# EAGLE design PiezoAmpHVDC (EAGLE 6.5.0)
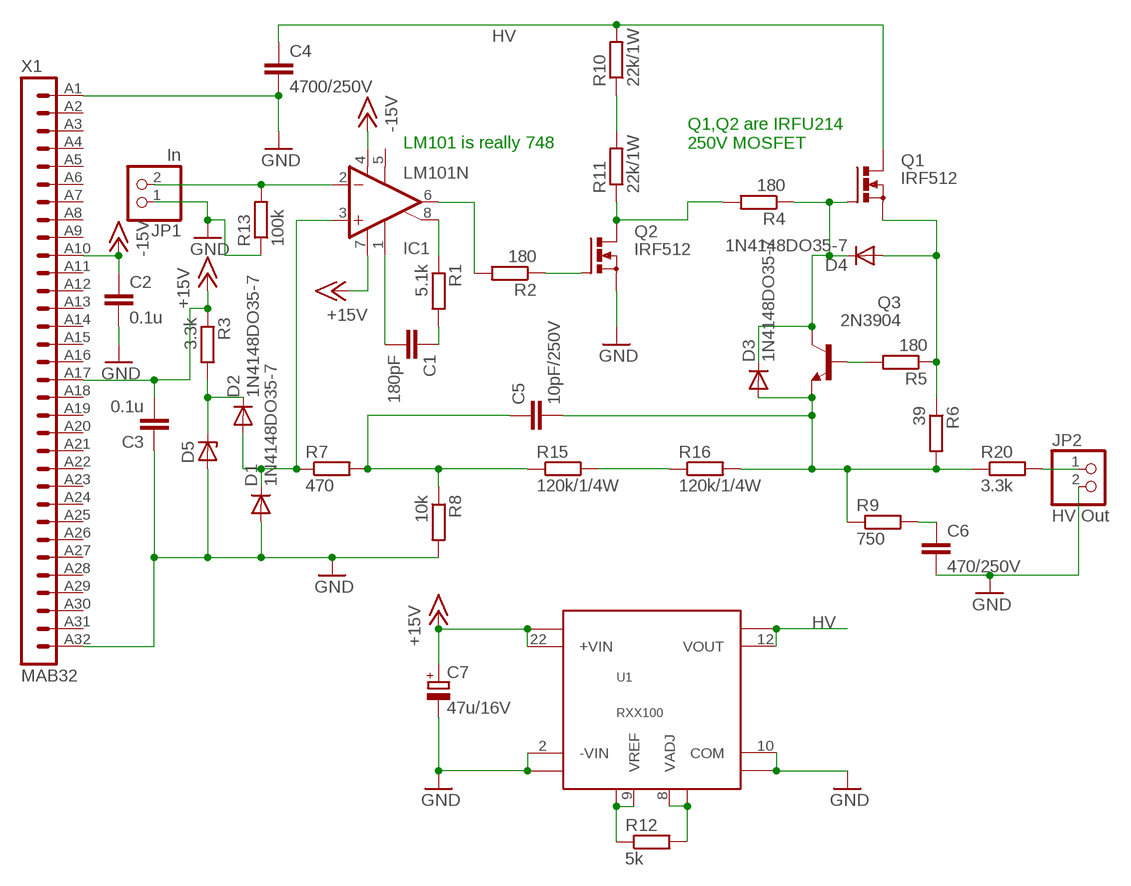
[diagram p0: schematic, sheet 1]

## Parts
C1  180pF  C-EU050-030X075  [C050-030X075]
C2  0.1u  C-EU050-030X075  [C050-030X075]
C3  0.1u  C-EU050-030X075  [C050-030X075]
C4  4700/250V  C-EU075-032X103  [C075-032X103]
C5  10pF/250V  C-EU075-032X103  [C075-032X103]
C6  470/250V  C-EU075-032X103  [C075-032X103]
C7  47u/16V  CPOL-EUSANYO_F8  [SANYO-OSCON_F8]
D1  1N4148DO35-7  [DO35-7]
D2  1N4148DO35-7  [DO35-7]
D3  1N4148DO35-7  [DO35-7]
D4  1N4148DO35-7  [DO35-7]
D5  ZENER-DIODEDO34-7  [DO34Z7]
IC1  LM101N  [DIL08]
JP1  In  PINHD-1X2  [1X02]
JP2  HV Out  PINHD-1X2  [1X02]
Q1  IRF512  [TO220BV]
Q2  IRF512  [TO220BV]
Q3  2N3904  [TO92]
R1  5.1k  R-EU_0204/7  [0204/7]
R2  180  R-EU_0204/7  [0204/7]
R3  3.3k  R-EU_0204/7  [0204/7]
R4  180  R-EU_0204/7  [0204/7]
R5  180  R-EU_0204/7  [0204/7]
R6  39  R-EU_0204/7  [0204/7]
R7  470  R-EU_0204/7  [0204/7]
R8  10k  R-EU_0204/7  [0204/7]
R9  750  R-EU_0204/7  [0204/7]
R10  22k/1W  R-EU_0411/15  [0411/15]
R11  22k/1W  R-EU_0411/15  [0411/15]
R12  5k  R-EU_0204/7  [0204/7]
R13  100k  R-EU_0204/5  [0204/5]
R15  120k/1/4W  R-EU_0411/15  [0411/15]
R16  120k/1/4W  R-EU_0411/15  [0411/15]
R20  3.3k  R-EU_0204/7  [0204/7]
U1  RXX100  [RXXDIP]
X1  MAB32  [MAB32]

## Nets
+15V: C3.2 C7.+ IC1.7(V+) R3.1 U1.22(+VIN) U1.23(VIN2+) X1.A17
-15V: C2.1 IC1.4(V-) X1.A10
GND: C2.2 C3.1 C4.2 C6.2 C7.- D1.A D5.A JP1.1 JP2.2 Q2.S R8.2 R13.1 U1.2(-VIN) U1.3(VIN2-) U1.10(COM) U1.15(COM2) X1.A1 X1.A32
HV: C4.1 Q1.D R10.2 U1.12(VOUT) U1.13(VOUT2)
N$1: IC1.2(-IN) JP1.2 R13.2
N$2: R10.1 R11.2
N$3: Q2.G R2.1
N$4: Q2.D R4.2 R11.1
N$5: C6.1 R9.2
N$6: R12.2 U1.8(VADJ) U1.17(VADJ2)
N$7: IC1.8(ON2) R1.1
N$8: IC1.6(OUT) R2.2
N$9: R12.1 U1.9(VREF) U1.16(VREF2)
N$11: D3.C D4.C Q1.G Q3.1(C) R4.1
N$12: D4.A Q1.S R5.1 R6.1
N$14: Q3.2(B) R5.2
N$15: C5.2 D3.A Q3.3(E) R6.2 R9.1 R16.2 R20.1
N$19: R15.2 R16.1
N$20: C5.1 R7.2 R8.1 R15.1
N$21: D1.C D2.A IC1.3(+IN) R7.1
N$23: D2.C D5.C R3.2
N$25: JP2.1 R20.2
N$26: C1.1 R1.2
N$27: C1.2 IC1.1(ON1)
Unconnected: IC1.5(OPT) X1.A2 X1.A3 X1.A4 X1.A5 X1.A6 X1.A7 X1.A8 X1.A9 X1.A11 X1.A12 X1.A13 X1.A14 X1.A15 X1.A16 X1.A18 X1.A19 X1.A20 X1.A21 X1.A22 X1.A23 X1.A24 X1.A25 X1.A26 X1.A27 X1.A28 X1.A29 X1.A30 X1.A31

## Notes on the sheet
- LM101 is really 748
- Q1,Q2 are IRFU214
  250V MOSFET

## Library data of the parts
C1-C6 = rcl:C-EU: CAPACITOR, European symbol
C7 = rcl:CPOL-EU: POLARIZED CAPACITOR, European symbol
D1-D4 = diode:1N4148: DIODE high speed (Philips)
D5 = diode:ZENER-DIODE: Z-Diode
IC1 = linear:LM101: OP AMP
JP1 JP2 = pinhead:PINHD-1X2: PIN HEADER
Q1 Q2 = transistor-power:IRF512: N-CHANNEL MOS FET
Q3 = transistor-npn:2N3904: NPN Transistor
R1-R13 R15 R16 R20 = rcl:R-EU_: RESISTOR, European symbol
U1 = custom_parts:RXX100: Innoline Rxx-100_150B DC/DC converters
X1 = con-vg:MAB32: CONNECTOR male, 32 pins, type B, row A, grid 2.54 mm

## Board
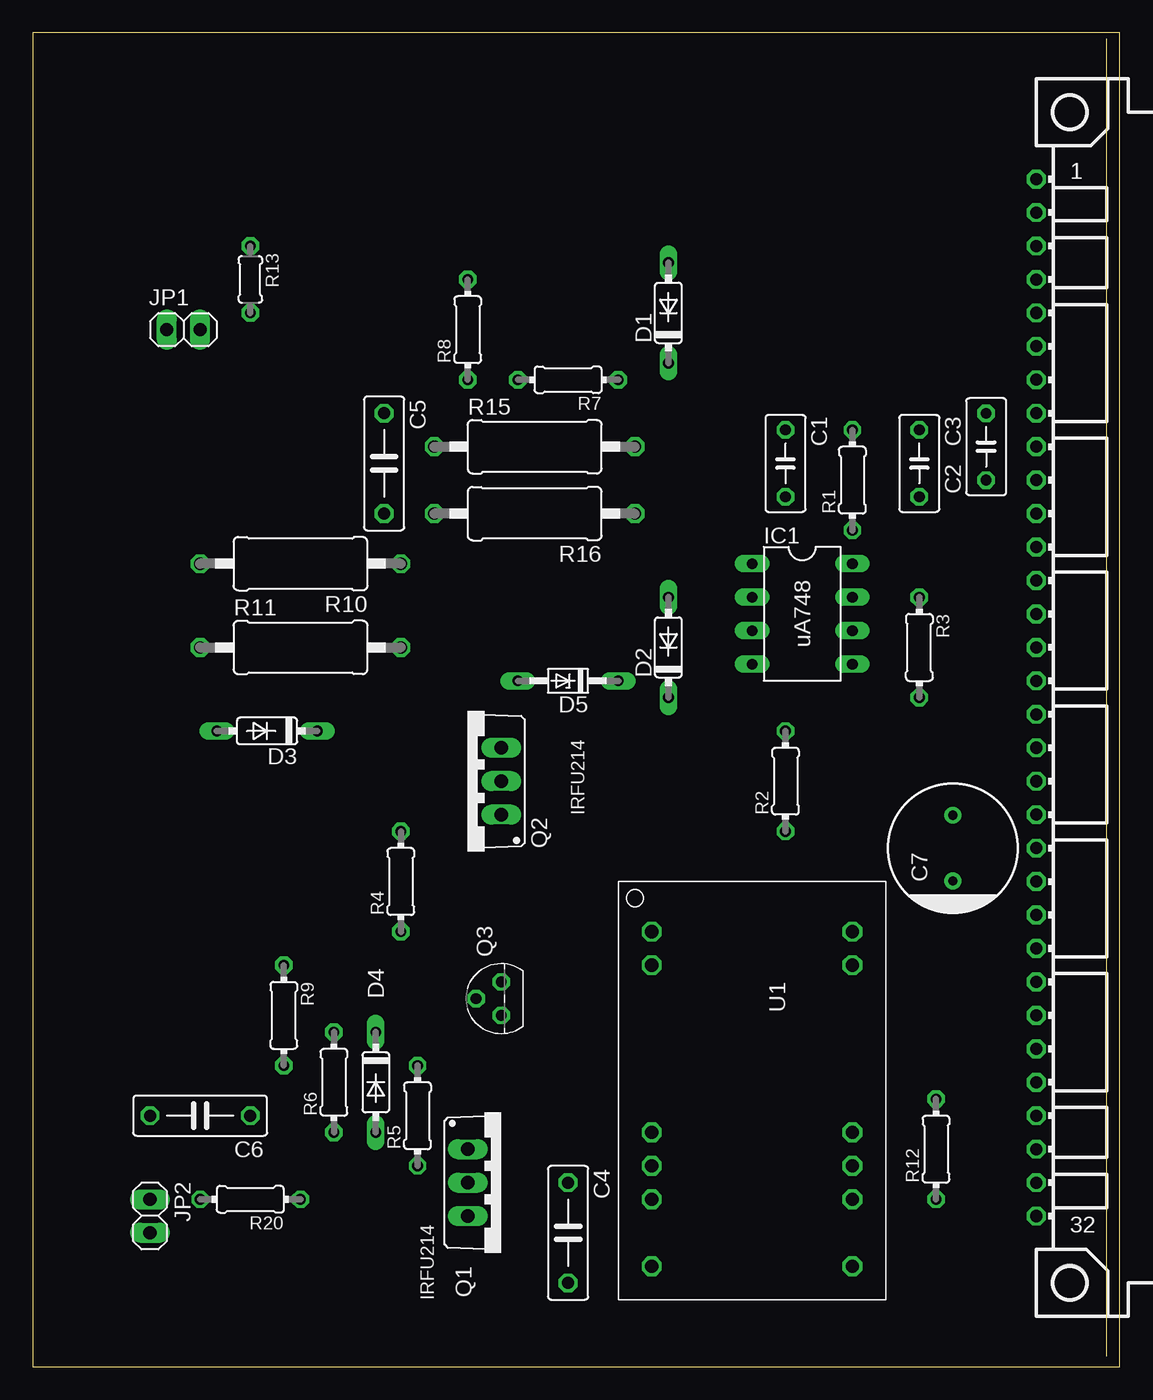
[diagram p1: board, top side]
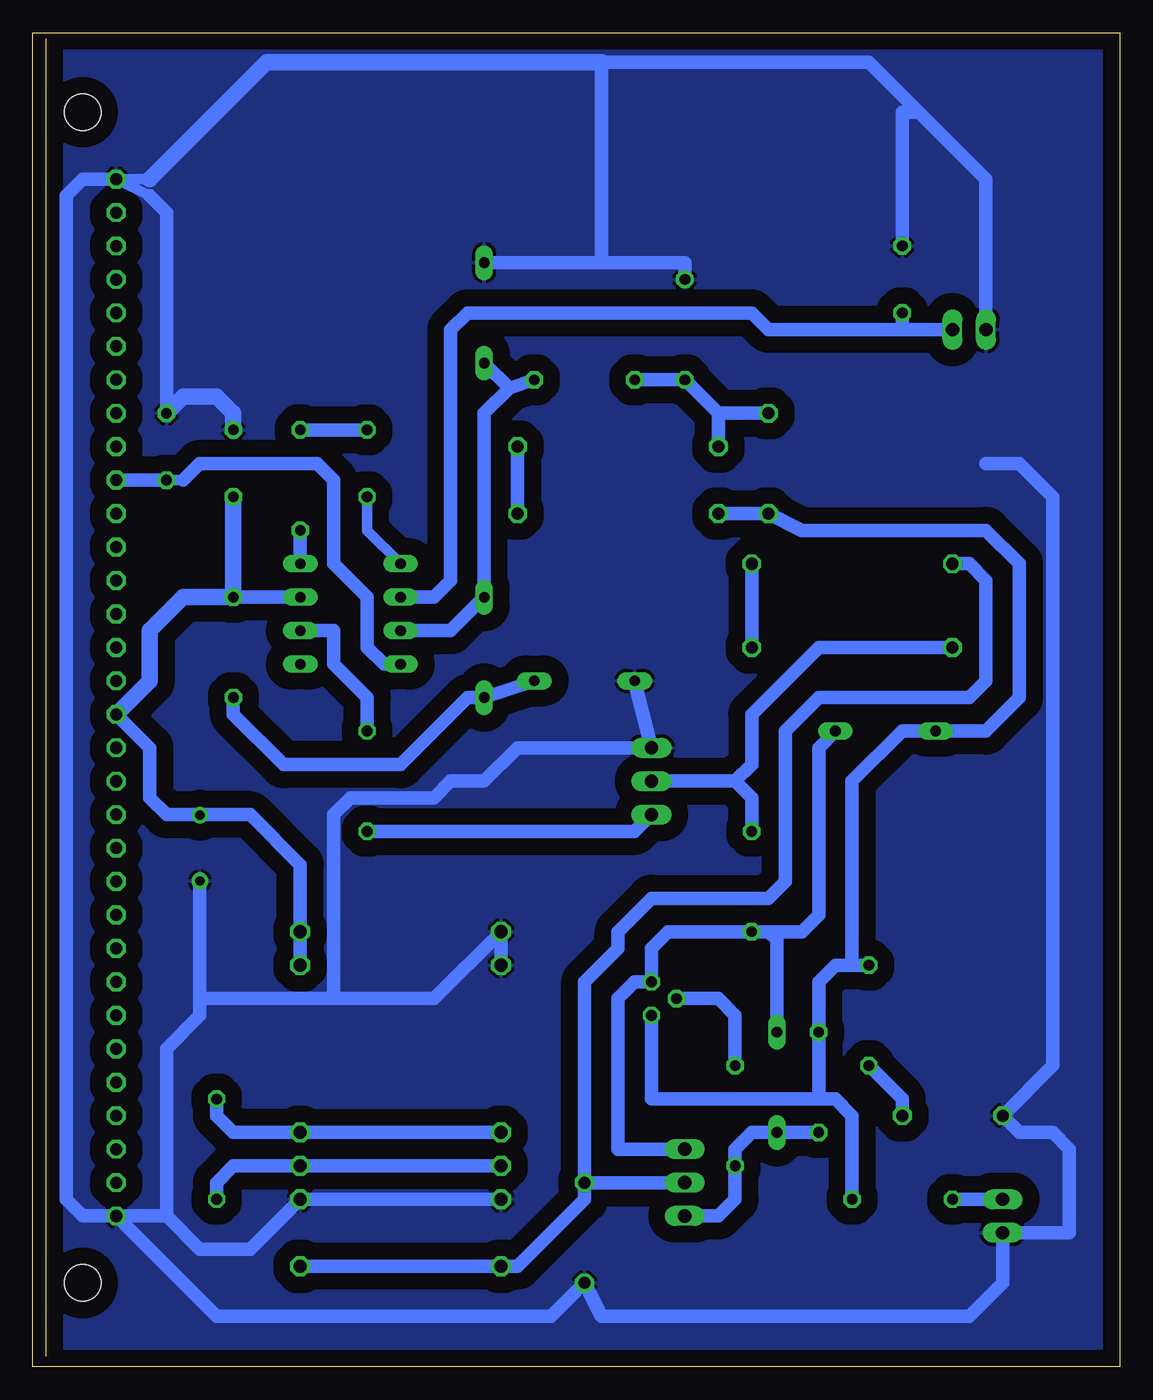
[diagram p2: board, bottom side, seen from below]

Size 82.53 x 101.27 mm. Coordinates in mm from the lower left corner, seen from the top.
Outline: 0,0 82.53,0 82.53,101.27 0,101.27 0,0
Copper layers (1*16): Top 0.035mm / dielectric 1.5mm / Bottom 0.035mm
Design rules "default": minimum track width 10mil, minimum drill 24mil, track to track 8mil, track to pad 8mil, pad to pad 8mil, via to via 8mil, smd to smd 8mil, copper to edge 40mil, drill to drill 8mil, minimum pad ring 10mil, minimum via ring 8mil, stop-mask expansion 4mil, vias tented up to drill 0mil, thermal gap 10mil

### Footprints (pad centres in the part's own frame; a part is rotated, then mirrored left to right if it is on the bottom)
C050-030X075 = drill 0.813 octagon: 1 -2.54,0; 2 2.54,0
C075-032X103 = drill 0.914 octagon: 1 -3.81,0; 2 3.81,0
SANYO-OSCON_F8 = drill 0.7 pad 1.27: + 2.5,0; - -2.5,0
DO35-7 = drill 0.813 long: A 3.81,0; C -3.81,0
DO34Z7 = drill 0.813 long: A 3.81,0; C -3.81,0
DIL08 = drill 0.813 long: 1 -3.81,-3.81; 2 -1.27,-3.81; 3 1.27,-3.81; 4 3.81,-3.81; 5 3.81,3.81; 6 1.27,3.81; 7 -1.27,3.81; 8 -3.81,3.81
1X02 = drill 1.016 long: 1 -1.27,0; 2 1.27,0
TO220BV = drill 1.016 long: D 0,-2.54; G -2.54,-2.54; S 2.54,-2.54
TO92 = drill 0.813 octagon: 1 1.27,0; 2 0,1.905; 3 -1.27,0
0204/7 = drill 0.813 octagon: 1 -3.81,0; 2 3.81,0
0411/15 = drill 0.914 octagon: 1 -7.62,0; 2 7.62,0
0204/5 = drill 0.813 octagon: 1 -2.54,0; 2 2.54,0
RXXDIP = drill 1 octagon: 2 -12.7,-7.62; 3 -10.16,-7.62; 8 2.54,-7.62; 9 5.08,-7.62; 10 7.62,-7.62; 12 12.7,-7.62; 13 12.7,7.62; 15 7.62,7.62; 16 5.08,7.62; 17 2.54,7.62; 22 -10.16,7.62; 23 -12.7,7.62
MAB32 = drill 0.914 octagon: A1 -2.54,39.37; A2 -2.54,36.83; A3 -2.54,34.29; A4 -2.54,31.75; A5 -2.54,29.21; A6 -2.54,26.67; A7 -2.54,24.13; A8 -2.54,21.59; A9 -2.54,19.05; A10 -2.54,16.51; A11 -2.54,13.97; A12 -2.54,11.43; A13 -2.54,8.89; A14 -2.54,6.35; A15 -2.54,3.81; A16 -2.54,1.27; A17 -2.54,-1.27; A18 -2.54,-3.81; A19 -2.54,-6.35; A20 -2.54,-8.89; A21 -2.54,-11.43; A22 -2.54,-13.97; A23 -2.54,-16.51; A24 -2.54,-19.05; A25 -2.54,-21.59; A26 -2.54,-24.13; A27 -2.54,-26.67; A28 -2.54,-29.21; A29 -2.54,-31.75; A30 -2.54,-34.29; A31 -2.54,-36.83; A32 -2.54,-39.37 | hole 2.794: 0,44.45; 0,-44.45

### Placement (x,y rotation side)
C1  57.15,68.58 270 top
C2  72.39,69.85 90 top
C3  67.31,68.58 270 top
C4  40.64,10.16 270 top
C5  26.67,68.58 270 top
C6  12.7,19.05 180 top
C7  69.85,39.37 90 top
D1  48.26,80.01 90 top
D2  48.26,54.61 90 top
D3  17.78,48.26 180 top
D4  26.03,21.59 270 top
D5  40.64,52.07 180 top
IC1  58.42,57.15 270 top
JP1  11.43,78.74 0 top
JP2  8.89,11.43 270 top
Q1  35.56,13.97 270 top
Q2  33.02,44.45 90 top
Q3  35.56,27.94 90 top
R1  62.23,67.31 90 top
R2  57.15,44.45 90 top
R3  67.31,54.61 270 top
R4  27.94,36.83 90 top
R5  29.21,19.05 90 top
R6  22.86,21.59 90 top
R7  40.64,74.93 180 top
R8  33.02,78.74 90 top
R9  19.05,26.67 270 top
R10  20.32,60.96 180 top
R11  20.32,54.61 0 top
R12  68.58,16.51 90 top
R13  16.51,82.55 270 top
R15  38.1,69.85 0 top
R16  38.1,64.77 180 top
R20  16.51,12.7 180 top
U1  54.61,20.32 270 top
X1  78.74,50.8 0 top

### Tracks (layer width: path | path; a pad name or v marks a point on that pad's centre or on a via)
+15V
  Bottom 1.016: IC1.7 R3.1 | U1.22 U1.23 62.23,38.1 66.04,41.91 69.81,41.91 C7.+ 69.89,41.91 72.39,41.91 73.66,43.18 73.66,46.99 X1.A17
  Bottom 1.27: X1.A17 73.66,52.07 73.66,55.88 71.12,58.42 R3.1 C3.2
-15V
  Bottom 0.813: 71.12,67.31 C2.1
  Bottom 1.016: IC1.4 55.88,53.34 57.15,54.61 57.15,58.42 59.69,60.96 59.69,67.31 60.96,68.58 69.85,68.58 71.12,67.31 | C2.1 X1.A10
GND
  Bottom 0.813: 73.66,88.9 X1.A1 73.66,90.17
  Bottom 1.016: C2.2 72.39,87.63 73.66,88.9 | U1.10 U1.15 66.04,8.89 69.85,8.89 72.39,11.43 | U1.3 U1.2 52.07,27.94 59.69,27.94 | 10.16,68.58 7.62,68.58 5.08,66.04 5.08,22.86 C6.2 7.62,17.78 5.08,17.78 3.81,16.51 3.81,10.16 JP2.2 8.89,6.35 11.43,3.81 39.37,3.81 C4.2 43.18,3.81 68.58,3.81 X1.A32 | D5.A Q2.S 45.72,46.99 48.26,44.45 50.8,44.45 52.07,43.18 58.42,43.18 59.69,41.91 59.69,27.94 | X1.A32 78.74,11.43 80.01,12.7 80.01,88.9 78.74,90.17 X1.A1 | 15.24,95.25 10.16,90.17 JP1.1 | 15.24,95.25 19.05,99.06 39.37,99.06 39.37,83.82 | 59.69,27.94 69.85,27.94 | 69.85,27.94 C7.- | X1.A32 72.39,11.43 | 69.85,27.94 69.85,26.67 72.39,24.13 72.39,11.43 | D1.A 39.37,83.82 | 39.37,83.82 33.02,83.82 R8.2 | 15.24,95.25 16.51,95.25 R13.1
  Bottom 1.27: 39.37,99.06 64.77,99.06 73.66,90.17 | C3.1 67.31,72.39 68.58,73.66 71.12,73.66 C2.2
  pour Bottom (isolate 1.27): 82.55,101.6 0,101.6 0,0 82.55,0
HV
  Bottom 1.016: U1.13 U1.12 45.72,7.62 40.64,12.7 C4.1 | C4.1 40.64,29.21 38.1,31.75 38.1,33.02 35.56,35.56 26.67,35.56 25.4,36.83 25.4,48.26 22.86,50.8 11.43,50.8 10.16,52.07 10.16,59.69 11.43,60.96 R10.2 | C4.1 Q1.D
N$1
  Bottom 1.016: IC1.2 52.07,58.42 50.8,59.69 50.8,78.74 49.53,80.01 27.94,80.01 26.67,78.74 16.51,78.74 | JP1.2 16.51,78.74 | R13.2 16.51,78.74
N$2
  Bottom 1.016: R10.1 R11.2
N$3
  Bottom 1.016: R2.1 36.83,40.64 Q2.G
N$4
  Bottom 1.016: Q2.D 29.21,44.45 | R4.2 27.94,43.18 29.21,44.45 | R11.1 22.86,54.61 27.94,49.53 27.94,45.72 29.21,44.45
N$5
  Bottom 1.016: C6.1 16.51,20.32 R9.2
N$6
  Bottom 1.016: U1.8 U1.17 67.31,17.78 68.58,19.05 R12.2
N$7
  Bottom 1.016: IC1.8 R1.1
N$8
  Bottom 1.016: IC1.6 59.69,55.88 59.69,53.34 57.15,50.8 R2.2
N$9
  Bottom 1.016: U1.9 U1.16 67.31,15.24 68.58,13.97 R12.1
N$11
  Bottom 1.016: 26.67,33.02 R4.1 34.29,33.02 35.56,31.75 Q3.1 36.83,29.21 38.1,27.94 38.1,16.51 Q1.G | 26.67,33.02 24.13,33.02 22.86,34.29 22.86,46.99 D3.C | D4.C 26.03,32.38 26.67,33.02
N$12
  Bottom 1.016: R6.1 D4.A 27.94,17.78 29.21,16.51 R5.1 29.21,12.7 30.48,11.43 Q1.S
N$14
  Bottom 1.016: Q3.2 30.48,27.94 29.21,26.67 R5.2
N$15
  Bottom 1.016: Q3.3 35.56,20.32 22.86,20.32 | 22.86,20.32 R6.2 22.86,29.21 21.59,30.48 20.32,30.48 | 20.32,30.48 20.32,44.45 16.51,48.26 D3.A 10.16,48.26 7.62,50.8 7.62,60.96 10.16,63.5 24.13,63.5 C5.2 R16.2 | 20.32,30.48 R9.1 | 22.86,20.32 21.59,20.32 20.32,19.05 R20.1
N$19
  Bottom 1.016: R15.2 R16.1
N$20
  Bottom 1.016: R7.2 R8.1 30.48,72.39 | 30.48,72.39 C5.1 | R15.1 30.48,72.39
N$21
  Bottom 1.016: R7.1 46.36,74.3 | 46.36,74.3 D1.C | 46.36,74.3 48.26,72.39 D2.A 50.8,55.88 IC1.3
N$23
  Bottom 1.016: R3.2 67.31,49.53 63.5,45.72 54.61,45.72 49.53,50.8 D2.C D5.C
N$25
  Bottom 1.016: R20.2 JP2.1
N$26
  Bottom 1.016: C1.1 R1.2
N$27
  Bottom 0.813: C1.2 57.15,63.5 IC1.1

### Text on the board
tPlace: uA748 | IRFU214 | IRFU214